# Altium schematic sheet Connectors.SchDoc
size 420 x 297 mm
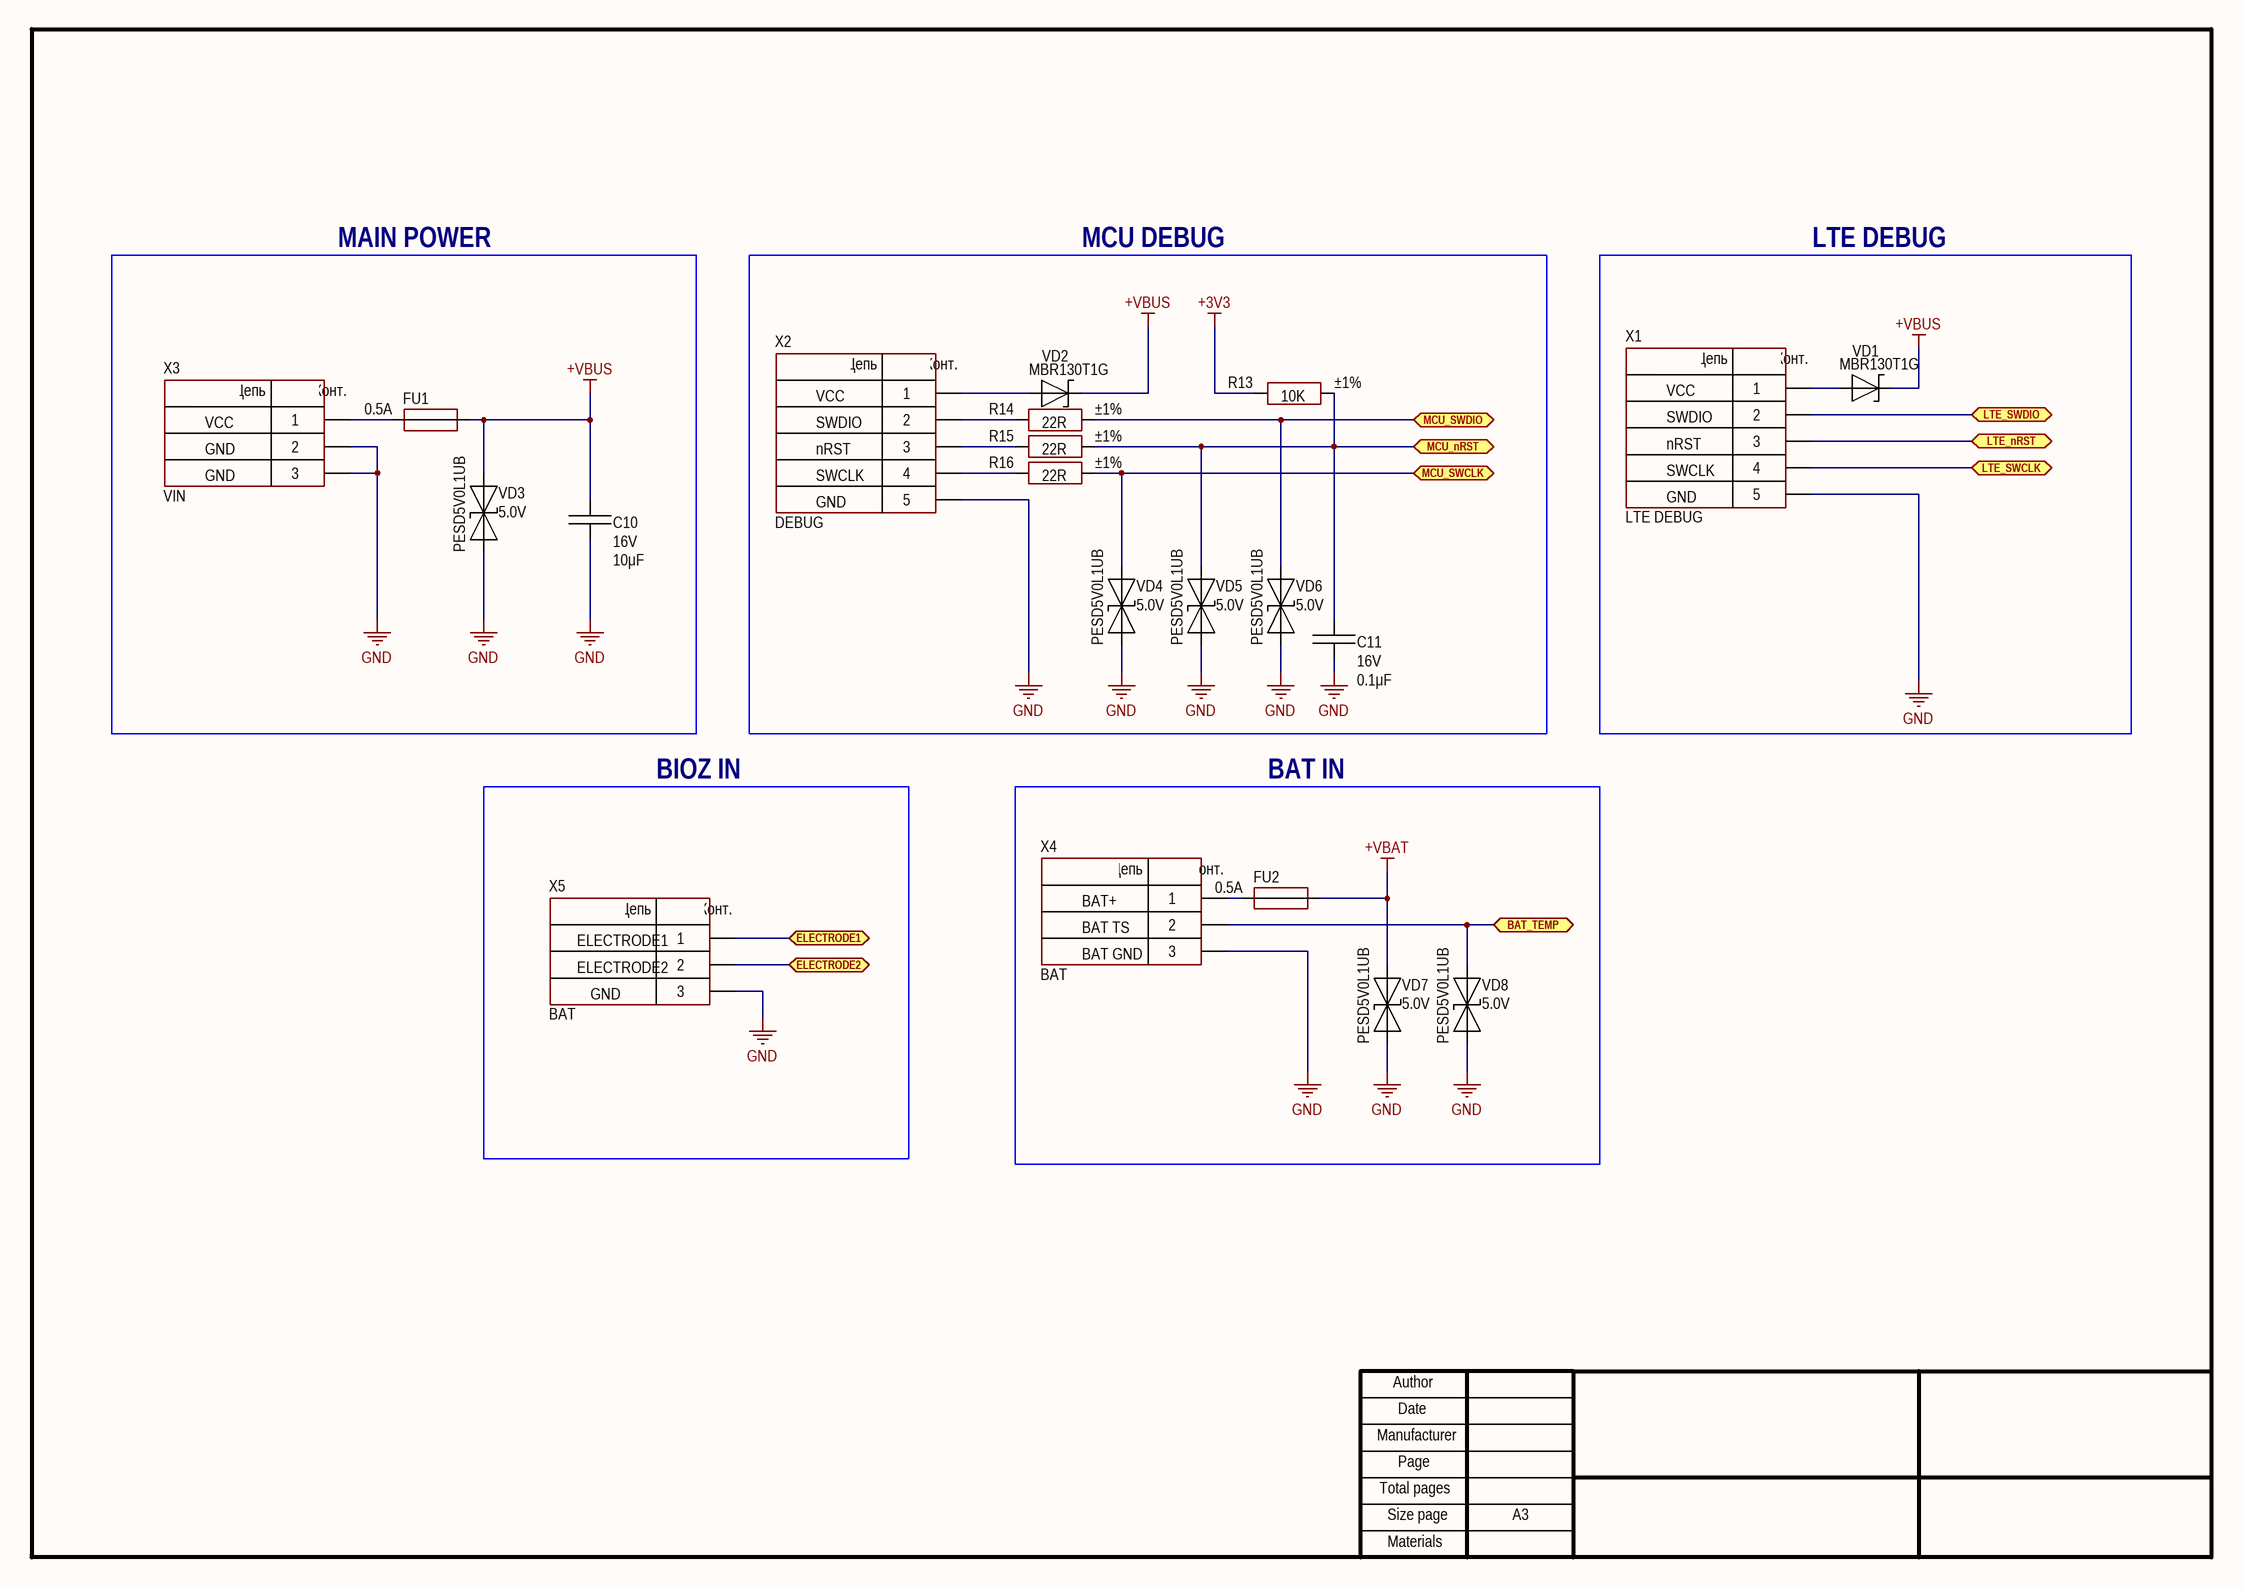
[diagram p0: Connectors.SchDoc]

## Parts
C10  value 10μF  Voltage: 16V  [CAP: 0805]
C11  value 0.1μF  Voltage: 16V  [CAP: 0805]
FU1  MaxCurrent: 0.5A  [FUSE: 1206]
FU2  MaxCurrent: 0.5A  [FUSE: 1206]
R13  value 10K  Tolerance: ±1%  [RES: 0805]
R14  value 22R  Tolerance: ±1%  [RES: 0805]
R15  value 22R  Tolerance: ±1%  [RES: 0805]
R16  value 22R  Tolerance: ±1%  [RES: 0805]
VD1  PartNumber: MBR130T1G  [DIODE: SOD123]
VD2  PartNumber: MBR130T1G  [DIODE: SOD123]
VD3  Voltage: 5.0V  PartNumber: PESD5V0L1UB  [DIODE: SOD523]
VD4  Voltage: 5.0V  PartNumber: PESD5V0L1UB  [DIODE: SOD523]
VD5  Voltage: 5.0V  PartNumber: PESD5V0L1UB  [DIODE: SOD523]
VD6  Voltage: 5.0V  PartNumber: PESD5V0L1UB  [DIODE: SOD523]
VD7  Voltage: 5.0V  PartNumber: PESD5V0L1UB  [DIODE: SOD523]
VD8  Voltage: 5.0V  PartNumber: PESD5V0L1UB  [DIODE: SOD523]
X1  CommentText: LTE DEBUG  [CON: PLS-5]
X2  CommentText: DEBUG  [CON: PLS-5]
X3  CommentText: VIN  [CON: DG350-3.5-03P]
X4  CommentText: BAT  [CON: DG350-3.5-03P]
X5  CommentText: BAT  [CON: DG350-3.5-03P]

## Blocks framed on the sheet
MAIN POWER: C10 FU1 VD3 X3
MCU DEBUG: C11 R13-R16 VD2 VD4-VD6 X2
LTE DEBUG: VD1 X1
BIOZ IN: X5
BAT IN: FU2 VD7 VD8 X4

## Ports
BAT_TEMP (bidir), ELECTRODE1 (bidir), ELECTRODE2 (bidir), LTE_nRST (bidir), LTE_SWCLK (bidir), LTE_SWDIO (bidir), MCU_nRST (bidir), MCU_SWCLK (bidir), MCU_SWDIO (bidir)

## Nets
+3V3: R13.1
+VBAT: FU2.2 VD7.2(C)
+VBUS: C10.2 FU1.2 VD1.2 VD2.2 VD3.2(C)
GND: C10.1 C11.1 VD3.1(A) VD4.1(A) VD5.1(A) VD6.1(A) VD7.1(A) VD8.1(A) X1.5 X2.5 X3.2 X3.3 X4.3 X5.3
BAT_TEMP: VD8.2(C) X4.2 ; port BAT_TEMP
ELECTRODE1: X5.1 ; port ELECTRODE1
ELECTRODE2: X5.2 ; port ELECTRODE2
LTE_nRST: X1.3 ; port LTE_nRST
LTE_SWCLK: X1.4 ; port LTE_SWCLK
LTE_SWDIO: X1.2 ; port LTE_SWDIO
MCU_nRST: C11.2 R13.2 R15.2 VD5.2(C) ; port MCU_nRST
MCU_SWCLK: R16.2 VD4.2(C) ; port MCU_SWCLK
MCU_SWDIO: R14.2 VD6.2(C) ; port MCU_SWDIO
NetFU1_1: FU1.1 X3.1
NetFU2_1: FU2.1 X4.1
NetR14_1: R14.1 X2.2
NetR15_1: R15.1 X2.3
NetR16_1: R16.1 X2.4
NetVD1_1: VD1.1 X1.1
NetVD2_1: VD2.1 X2.1

## Notes on the sheet
- VCC
- GND
- nRST
- SWDIO
- SWCLK
- BAT+
- BAT TS
- (near X5) ELECTRODE1
- (near X5) ELECTRODE2
- BAT GND
- Author
- Manufacturer
- Date
- Page
- Total pages
- Size page
- A3
- Materials
- (in symbol Connector_terminal_3pin) Цепь; Конт.
- (in symbol PLS-5) Цепь; Конт.

## Library data of the parts
C10 = Ceramic_0805: 10 µF ±20% 16V Ceramic Capacitor X7R 0805 (2012 Metric); Manufacturer: Yageo; PartNumber: CC0805MKX7R7BB106; ValueManufacturerPartNumber: Ceramic capacitor, 10μF, X7R, ±10%, 16V, 0805, -55...+125°C; Tolerance: ±10%; Package: 0805; HelpURL: https://www.digikey.com/en/products/detail/yageo/CC0805MKX7R7BB106/7164392; Temperature: -55...+125°C; TypeCapacitor: Ceramic capacitor; TypeDielectric: X7R
C11 = Ceramic_0805: Manufacturer: Yageo; PartNumber: CC0805KRX7R7BB104; ValueManufacturerPartNumber: Ceramic capacitor, 0.1μF, X7R, ±10%, 16V, 0805, -55...+125°C; TypeCapacitor: Ceramic capacitor; Tolerance: ±10%; TypeDielectric: X7R; Package: 0805; HelpURL: https://www.digikey.com/product-detail/en/yageo/CC0805KRX7R7BB104/311-1142-1-ND/303052; Temperature: -55...+125°C
FU1 FU2 = Fuse: Polymeric PTC Resettable Fuse 6V 500 mA Ih Surface Mount 0805 (2012 Metric), Concave; Manufacturer: Bel Fuse; PartNumber: 0ZCK0050FF2E; TypeFuse: Electromechanics relay; VoltageMax: 250VAC; Package: 1206; HelpURL: https://www.digikey.com/en/products/detail/bel-fuse-inc/0ZCK0050FF2E/4156141; ValueManufacturerPartNumber: =TypeFuse+', '+VoltageMax+', '+MaxCurrent+', '+Package+', '+Temperature
R13 = Resistor_0805: 10 kOhms ±1% 0.125W, 1/8W Chip Resistor 0805 (2012 Metric) Moisture Resistant Thick Film; Manufacturer: Yageo; PartNumber: RC0805FR-0710KL; ValueManufacturerPartNumber: Resistor film, 10K, ±1%, 0805, 0.125W, -55...+125°C; TypeResistor: Resistor film; Package: 0805; HelpURL: https://www.digikey.com/en/products/detail/yageo/RC0805FR-0710KL/727535; Temperature: -55...+125°C; Power: 0.125W
R14-R16 = Resistor_0805: 22 Ohms ±1% 0.125W, 1/8W Chip Resistor 0805 (2012 Metric) Moisture Resistant Thick Film; Manufacturer: Yageo; PartNumber: RC0805FR-0722RL; ValueManufacturerPartNumber: Resistor film, 22R, ±1%, 0805, 0.125W, -55...+125°C; TypeResistor: Resistor film; Package: 0805; HelpURL: https://www.digikey.com/en/products/detail/yageo/RC0805FR-0722RL/727735; Temperature: -55...+125°C; Power: 0.125W
VD1 VD2 = Schottky_single: Diode Schottky 30 V 1A Surface Mount SOD-123; Manufacturer: Diodes Incorporated; ValueManufacturerPartNumber: Schottky diode, 30V, 1A, 0.45V, 15pF, SOD-123, -55...+150°C; TypeDiode: Schottky diode; Voltage: 30V; VoltageDrop: 0.45V; RecoveryTime: 15pF; Package: SOD-123; HelpURL: https://www.digikey.com/en/products/detail/on-semiconductor/MBR130T1G/918582; Temperature: -55...+150°C; Current: 1A
VD3-VD8 = TVS_single: 12V Clamp 3.5A (8/20µs) Ipp Tvs Diode Surface Mount SOD-523; Manufacturer: Nexperia; TypeDiode: ESD TVS diode; Package: SOD-523; HelpURL: https://www.digikey.com/en/products/detail/nexperia-usa-inc/PESD5V0L1UB115/2092297; ValueManufacturerPartNumber: =TypeDiode+', '+Voltage+', '+Current+', '+VoltageDrop+', '+RecoveryTime+', '+Package+', '+Temperature; Temperature: -55...+150°C; Current: 3.5A
X1 = PLS-5: Manufacturer: Connfly; ValueManufacturerPartNumber: Connector, 5pin, 2.54mm, 500VAC, 3A; TypeConnector: Connector; VoltageMax: 500VAC; Pitch: 2.54mm; CurrentMax: 3A; Multichannel: 5pin; HelpURL: https://www.chipdip.ru/product/pls-5; PartNumber: PLS-5
X2 = PLS-5: Connector Header Through Hole 5 position 0.100" (2.54mm); Manufacturer: Würth Elektronik; ValueManufacturerPartNumber: Connector, 5pin, 2.54mm, 500VAC, 3A; PartNumber: 61300511121; VoltageMax: 500VAC; CurrentMax: 3A; Multichannel: 5pin; HelpURL: https://www.digikey.com/en/products/detail/w%C3%BCrth-elektronik/61300511121/4846831; TypeConnector: Connector; Pitch: 2.54mm
X3-X5 = Connector_terminal_3pin: 3 Position Wire to Board Terminal Block Horizontal with Board 0.138" (3.50mm) Through Hole; Manufacturer: TE Connectivity; ValueManufacturerPartNumber: Terminal connector, 3pin, 3.5mm, 300VAC, 12A; PartNumber: 1546551-3; TypeConnector: Terminal connector; VoltageMax: 300VAC; Pitch: 3.5mm; CurrentMax: 12A; Multichannel: 3pin; HelpURL: https://www.digikey.com/en/products/detail/te-connectivity-amp-connectors/1546551-3/2221615